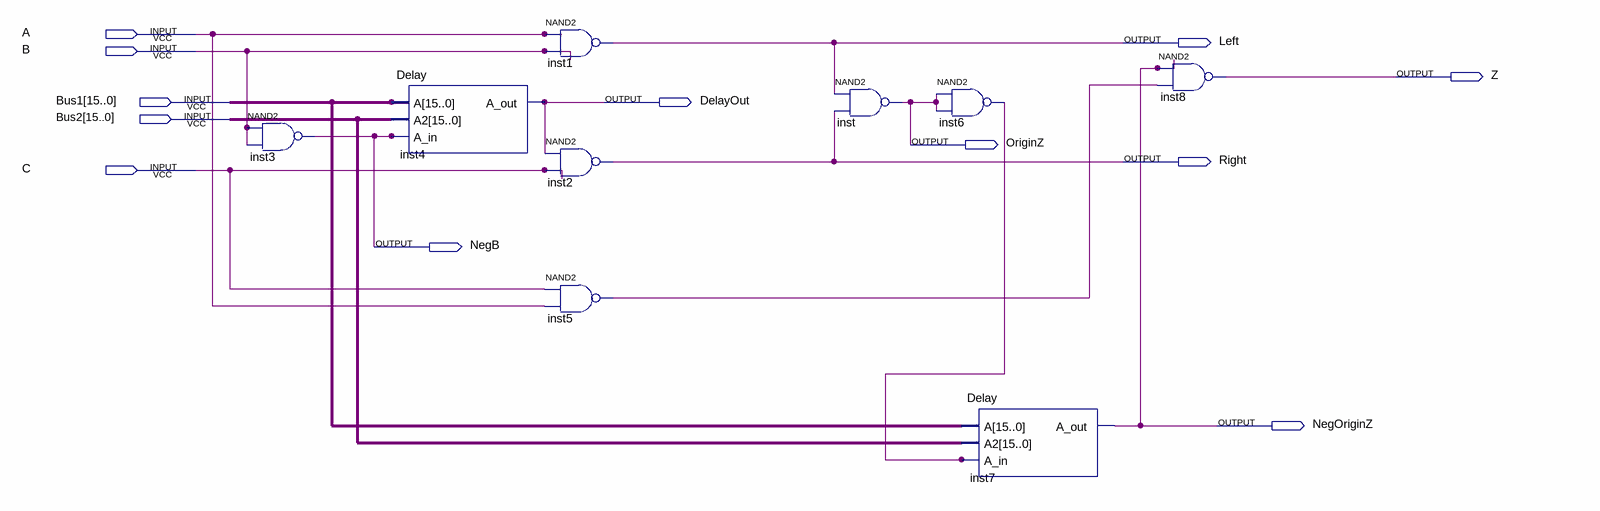
[diagram p0: schematic sheet]
// Quartus schematic lab1_eliminating_hazard.bdf as structural Verilog: 9 symbols, 12 pins
module lab1_eliminating_hazard (
  input  A,
  input  B,
  input  [15:0] Bus1,
  input  [15:0] Bus2,
  input  C,
  output Left,
  output Z,
  output DelayOut,
  output OriginZ,
  output Right,
  output NegB,
  output NegOriginZ
);

  wire inst5_out, inst6_out;

  nand inst3 (NegB, B, B);
  Delay inst4 (.A(Bus1), .A2(Bus2), .A_in(NegB), .A_out(DelayOut));
  nand inst1 (Left, A, B);
  nand inst2 (Right, DelayOut, C);
  nand inst5 (inst5_out, C, A);
  nand inst (OriginZ, Left, Right);
  nand inst6 (inst6_out, OriginZ, OriginZ);
  Delay inst7 (.A(Bus1), .A2(Bus2), .A_in(inst6_out), .A_out(NegOriginZ));
  nand inst8 (Z, NegOriginZ, inst5_out);
endmodule
